# Altium schematic sheet ADC.SchDoc: EEG Measurement Circuit
size A2; Date: 24/01/2025; DrawnBy: Giang Phan Truong; SheetNumber: 5; SheetTotal: 7; SPICEModelCacheAOHYPSCX: <root> / <DocumentId>AOHYPSCX</DocumentId> / <CacheFrame Number="0"> / <Model Name="0402_885012005063_220pf" Kind="CKT"> / <Text>******* / .subckt 0402_885012005063_220pF 1 2 / Rser 1 3 0.0328677075671 / Lser 2 4 3.55619232E-10 / C1 3 4 0.00000000022 / Rpar 3 4 10000000000 / .ends 0402_885012005063_220pF</Text> / </Model> / <Model Name="0402_885012205060_680pf" Kind="CKT"> / <Text>******* / .subckt 0402_885012205060_680pF 1 2 / Rser 1 3 0.291776877274 / Lser 2 4 1.90727531E-10 / C1 3 4 0.00000000068 / Rpar 3 4 10000000000 / .ends 0402_885012205060_680pF</Text> / </Model> / <Model Name="0402_885012205086_100nf" Kind="CKT"> / <Text>******* / .subckt 0402_885012205086_100nF 1 2 / Rser 1 3 0.07 / Lser 2 4 0.00000000055 / C1 3 4 0.0000001 / Rpar 3 4 1000000000 / .ends 0402_885012205086_100nF</Text> / </Model> / <Model Name="0402_885012105012_1uf" Kind="CKT"> / <Text>******* / .subckt 0402_885012105012_1uF 1 2 / Rser 1 3 0.00986403339919 / Lser 2 4 3.2821055E-10 / C1 3 4 0.000001 / Rpar 3 4 50000000 / .ends 0402_885012105012_1uF</Text> / </Model> / </CacheFrame> / </root>
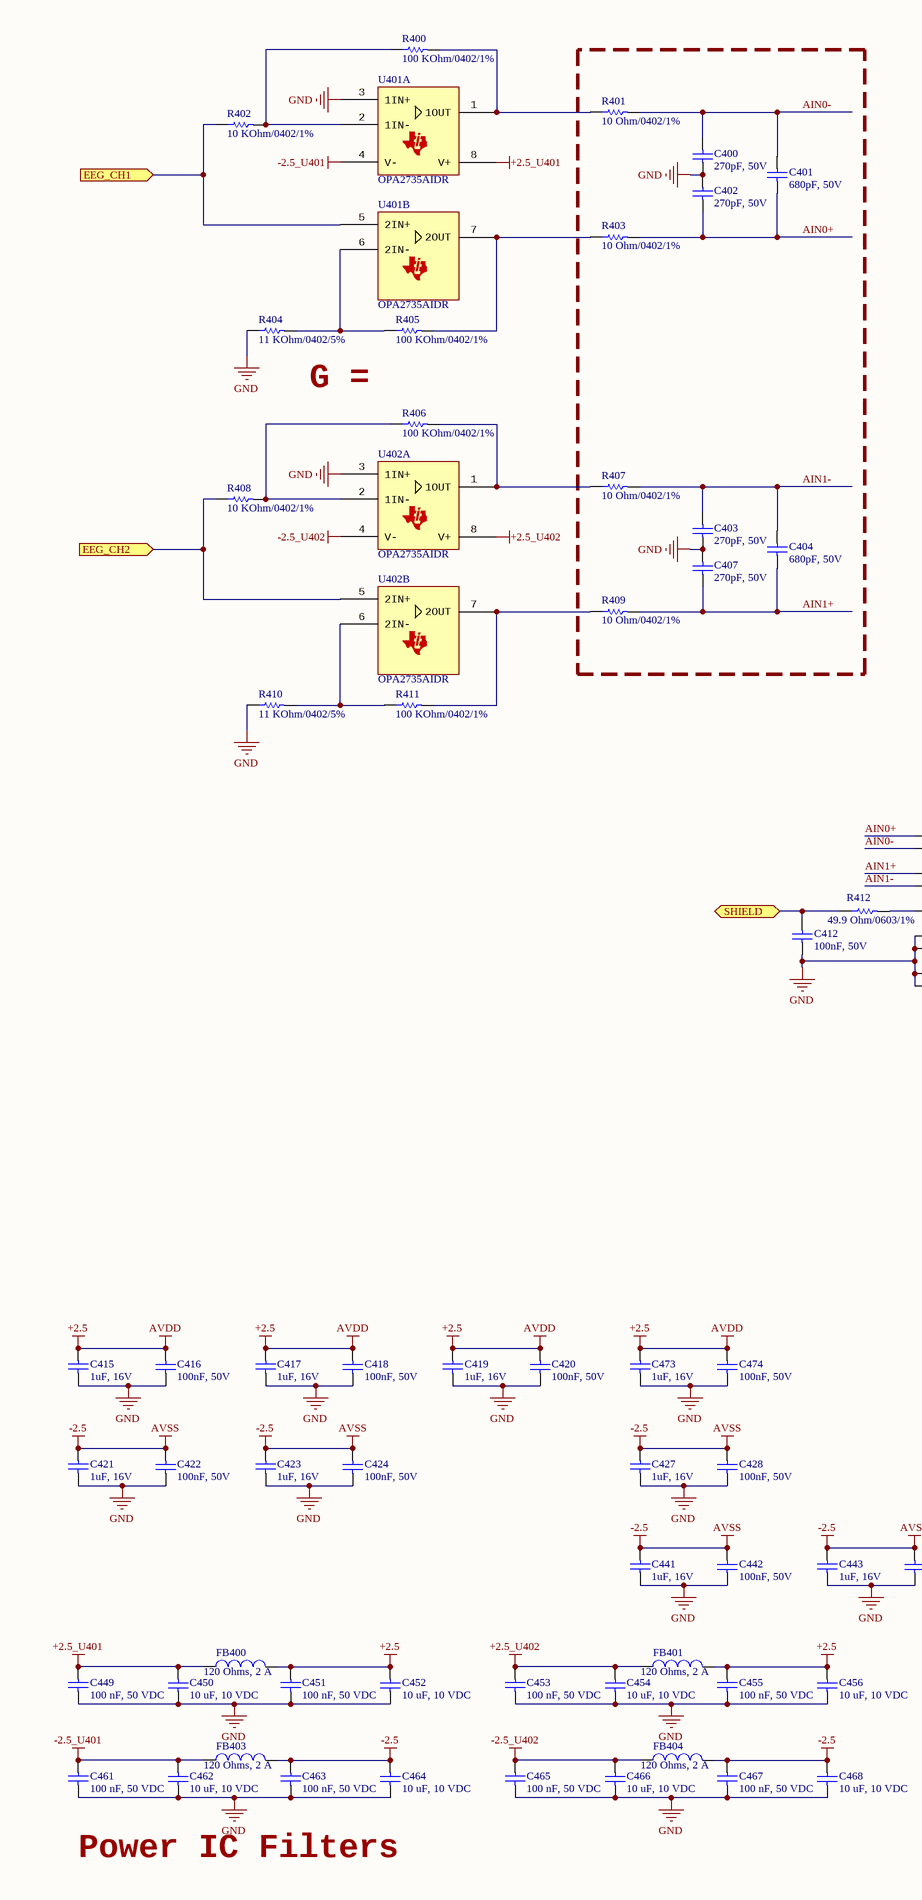
[diagram p0: ADC.SchDoc, left]
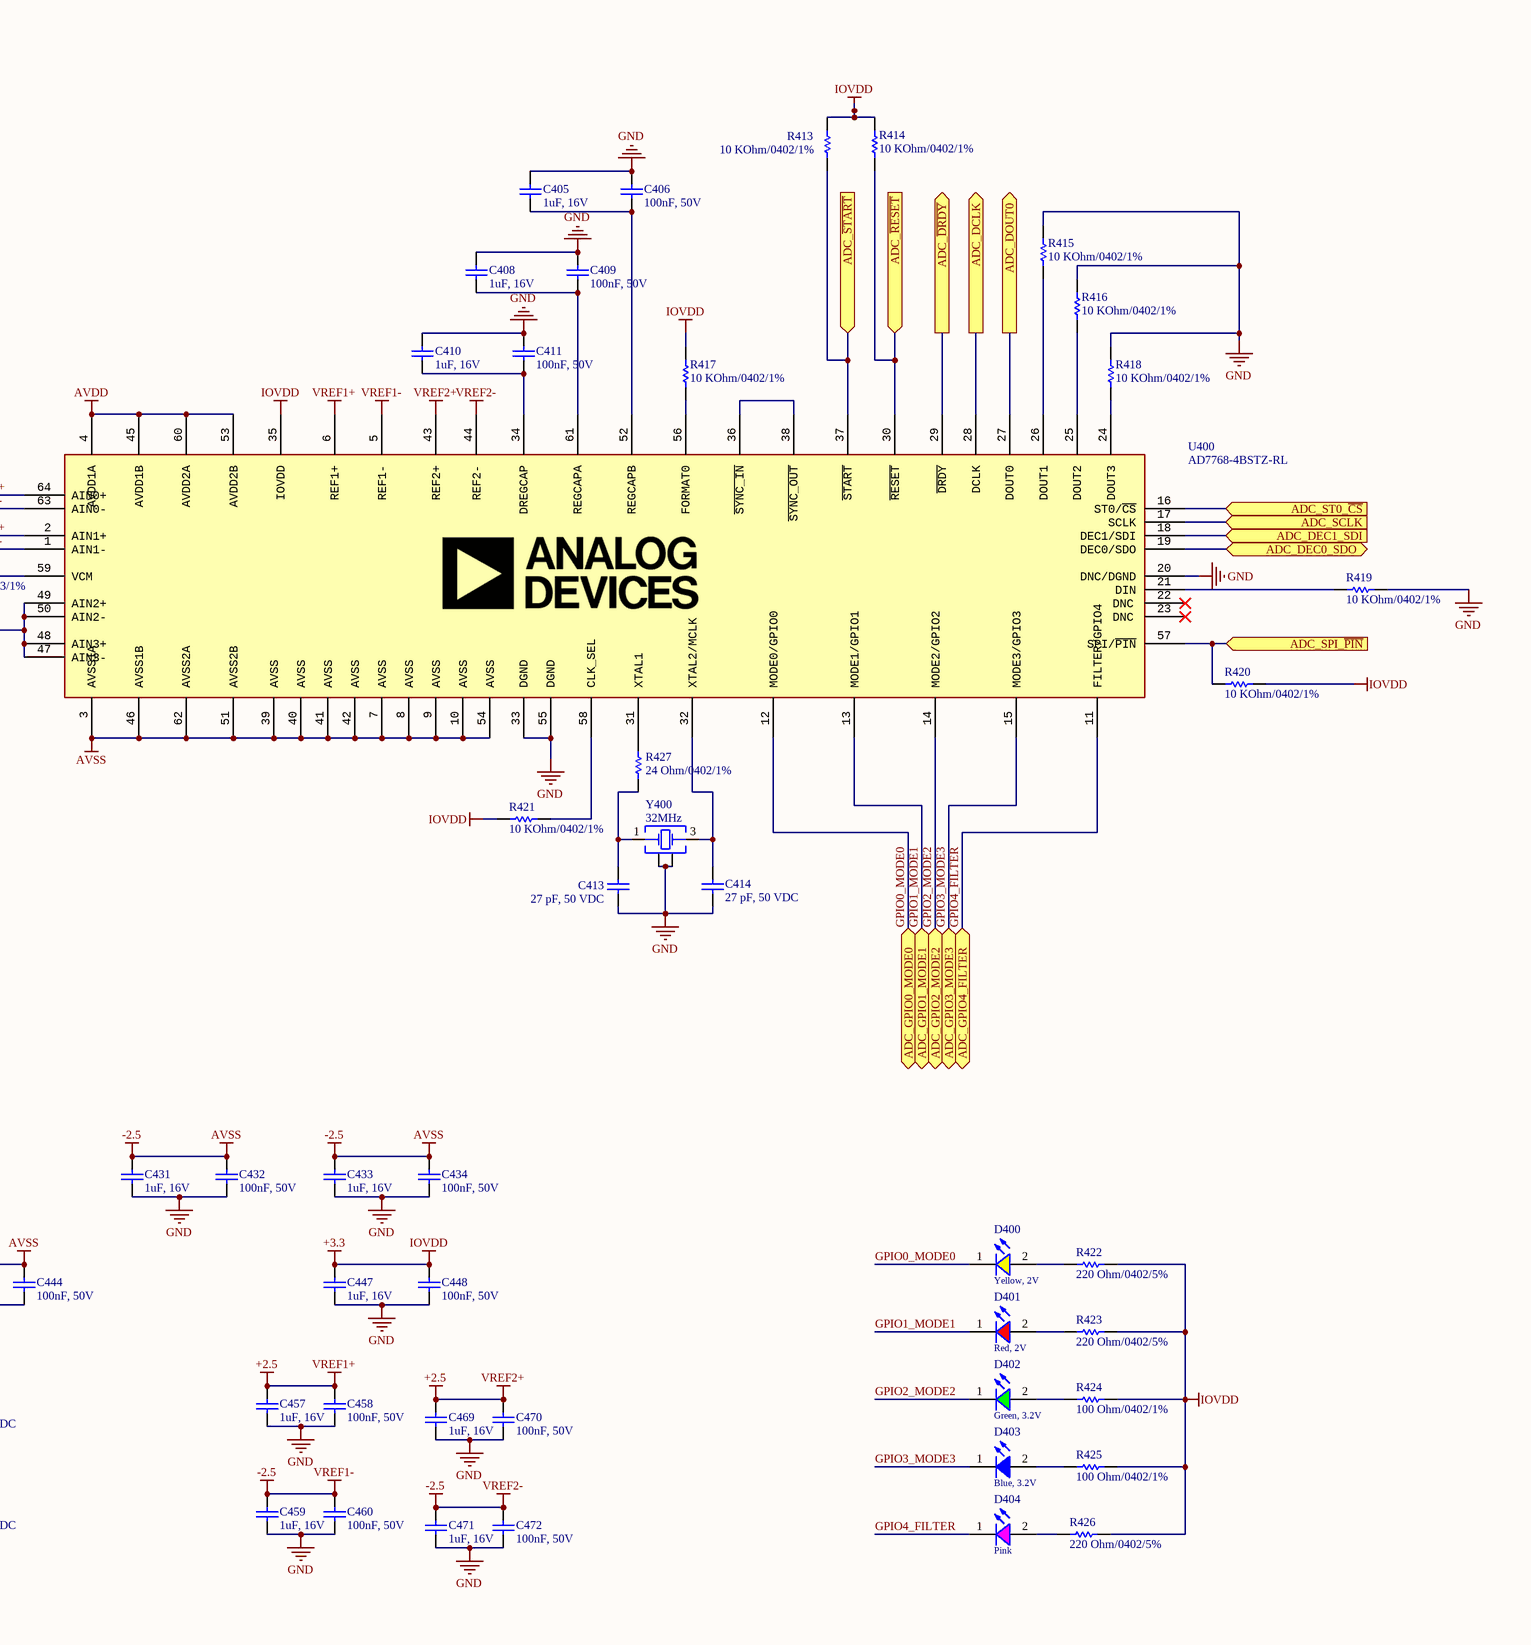
[diagram p1: ADC.SchDoc, right]

## Parts
C400  value 270pF, 50V  [WCAP-CSGP_0402_L1W0.5H0.5]  (hidden comment: 220pF)
C401  value 680pF, 50V  [WCAP-CSGP_0402_L1W0.5H0.5]  (hidden comment: 680pF)
C402  value 270pF, 50V  [WCAP-CSGP_0402_L1W0.5H0.5]  (hidden comment: 220pF)
C403  value 270pF, 50V  [WCAP-CSGP_0402_L1W0.5H0.5]  (hidden comment: 220pF)
C404  value 680pF, 50V  [WCAP-CSGP_0402_L1W0.5H0.5]  (hidden comment: 680pF)
C405  value 1uF, 16V  [WCAP-CSGP_0402_L1W0.5H0.5]  (hidden comment: 1μF)
C406  value 100nF, 50V  [WCAP-CSGP_0402_L1W0.5H0.5]  (hidden comment: 100nF)
C407  value 270pF, 50V  [WCAP-CSGP_0402_L1W0.5H0.5]  (hidden comment: 220pF)
C408  value 1uF, 16V  [WCAP-CSGP_0402_L1W0.5H0.5]  (hidden comment: 1μF)
C409  value 100nF, 50V  [WCAP-CSGP_0402_L1W0.5H0.5]  (hidden comment: 100nF)
C410  value 1uF, 16V  [WCAP-CSGP_0402_L1W0.5H0.5]  (hidden comment: 1μF)
C411  value 100nF, 50V  [WCAP-CSGP_0402_L1W0.5H0.5]  (hidden comment: 100nF)
C412  value 100nF, 50V  [WCAP-CSGP_0402_L1W0.5H0.5]  (hidden comment: 100nF)
C413  27 pF, 50 VDC  [CAP_0603]
C414  27 pF, 50 VDC  [CAP_0603]
C415  value 1uF, 16V  [WCAP-CSGP_0402_L1W0.5H0.5]  (hidden comment: 1μF)
C416  value 100nF, 50V  [WCAP-CSGP_0402_L1W0.5H0.5]  (hidden comment: 100nF)
C417  value 1uF, 16V  [WCAP-CSGP_0402_L1W0.5H0.5]  (hidden comment: 1μF)
C418  value 100nF, 50V  [WCAP-CSGP_0402_L1W0.5H0.5]  (hidden comment: 100nF)
C419  value 1uF, 16V  [WCAP-CSGP_0402_L1W0.5H0.5]  (hidden comment: 1μF)
C420  value 100nF, 50V  [WCAP-CSGP_0402_L1W0.5H0.5]  (hidden comment: 100nF)
C421  value 1uF, 16V  [WCAP-CSGP_0402_L1W0.5H0.5]  (hidden comment: 1μF)
C422  value 100nF, 50V  [WCAP-CSGP_0402_L1W0.5H0.5]  (hidden comment: 100nF)
C423  value 1uF, 16V  [WCAP-CSGP_0402_L1W0.5H0.5]  (hidden comment: 1μF)
C424  value 100nF, 50V  [WCAP-CSGP_0402_L1W0.5H0.5]  (hidden comment: 100nF)
C427  value 1uF, 16V  [WCAP-CSGP_0402_L1W0.5H0.5]  (hidden comment: 1μF)
C428  value 100nF, 50V  [WCAP-CSGP_0402_L1W0.5H0.5]  (hidden comment: 100nF)
C431  value 1uF, 16V  [WCAP-CSGP_0402_L1W0.5H0.5]  (hidden comment: 1μF)
C432  value 100nF, 50V  [WCAP-CSGP_0402_L1W0.5H0.5]  (hidden comment: 100nF)
C433  value 1uF, 16V  [WCAP-CSGP_0402_L1W0.5H0.5]  (hidden comment: 1μF)
C434  value 100nF, 50V  [WCAP-CSGP_0402_L1W0.5H0.5]  (hidden comment: 100nF)
C441  value 1uF, 16V  [WCAP-CSGP_0402_L1W0.5H0.5]  (hidden comment: 1μF)
C442  value 100nF, 50V  [WCAP-CSGP_0402_L1W0.5H0.5]  (hidden comment: 100nF)
C443  value 1uF, 16V  [WCAP-CSGP_0402_L1W0.5H0.5]  (hidden comment: 1μF)
C444  value 100nF, 50V  [WCAP-CSGP_0402_L1W0.5H0.5]  (hidden comment: 100nF)
C447  value 1uF, 16V  [WCAP-CSGP_0402_L1W0.5H0.5]  (hidden comment: 1μF)
C448  value 100nF, 50V  [WCAP-CSGP_0402_L1W0.5H0.5]  (hidden comment: 100nF)
C449  100 nF, 50 VDC  [CAP_0603]
C450  10 uF, 10 VDC  [CAP_0603]
C451  100 nF, 50 VDC  [CAP_0603]
C452  10 uF, 10 VDC  [CAP_0603]
C453  100 nF, 50 VDC  [CAP_0603]
C454  10 uF, 10 VDC  [CAP_0603]
C455  100 nF, 50 VDC  [CAP_0603]
C456  10 uF, 10 VDC  [CAP_0603]
C457  value 1uF, 16V  [WCAP-CSGP_0402_L1W0.5H0.5]  (hidden comment: 1μF)
C458  value 100nF, 50V  [WCAP-CSGP_0402_L1W0.5H0.5]  (hidden comment: 100nF)
C459  value 1uF, 16V  [WCAP-CSGP_0402_L1W0.5H0.5]  (hidden comment: 1μF)
C460  value 100nF, 50V  [WCAP-CSGP_0402_L1W0.5H0.5]  (hidden comment: 100nF)
C461  100 nF, 50 VDC  [CAP_0603]
C462  10 uF, 10 VDC  [CAP_0603]
C463  100 nF, 50 VDC  [CAP_0603]
C464  10 uF, 10 VDC  [CAP_0603]
C465  100 nF, 50 VDC  [CAP_0603]
C466  10 uF, 10 VDC  [CAP_0603]
C467  100 nF, 50 VDC  [CAP_0603]
C468  10 uF, 10 VDC  [CAP_0603]
C469  value 1uF, 16V  [WCAP-CSGP_0402_L1W0.5H0.5]  (hidden comment: 1μF)
C470  value 100nF, 50V  [WCAP-CSGP_0402_L1W0.5H0.5]  (hidden comment: 100nF)
C471  value 1uF, 16V  [WCAP-CSGP_0402_L1W0.5H0.5]  (hidden comment: 1μF)
C472  value 100nF, 50V  [WCAP-CSGP_0402_L1W0.5H0.5]  (hidden comment: 100nF)
C473  value 1uF, 16V  [WCAP-CSGP_0402_L1W0.5H0.5]  (hidden comment: 1μF)
C474  value 100nF, 50V  [WCAP-CSGP_0402_L1W0.5H0.5]  (hidden comment: 100nF)
D400  Yellow, 2V  [WL-SMCW_0603_H=0.7mm]
D401  Red, 2V  [WL-SMCW_0603_H=0.7mm]
D402  Green, 3.2V  [WL-SMCW_0603_H=0.7mm]
D403  Blue, 3.2V  [WL-SMCW_0603_H=0.7mm]
D404  Pink  [WL-SMCW_0603_H=0.7mm]
FB400  120 Ohms, 2 A  [FER_0603]
FB401  120 Ohms, 2 A  [FER_0603]
FB403  120 Ohms, 2 A  [FER_0603]
FB404  120 Ohms, 2 A  [FER_0603]
R400  value 100 KOhm/0402/1%  [R0402]  (hidden comment: Resistor 100 KOhm 0402 1%)
R401  value 10 Ohm/0402/1%  [R0402]  (hidden comment: Resistor 10 Ohm 0402 1%)
R402  value 10 KOhm/0402/1%  [R0402]  (hidden comment: Resistor 10 KOhm 0402 1%)
R403  value 10 Ohm/0402/1%  [R0402]  (hidden comment: Resistor 10 Ohm 0402 1%)
R404  value 11 KOhm/0402/5%  [R0402]  (hidden comment: Resistor 11 KOhm 0402 5%)
R405  value 100 KOhm/0402/1%  [R0402]  (hidden comment: Resistor 100 KOhm 0402 1%)
R406  value 100 KOhm/0402/1%  [R0402]  (hidden comment: Resistor 100 KOhm 0402 1%)
R407  value 10 Ohm/0402/1%  [R0402]  (hidden comment: Resistor 10 Ohm 0402 1%)
R408  value 10 KOhm/0402/1%  [R0402]  (hidden comment: Resistor 10 KOhm 0402 1%)
R409  value 10 Ohm/0402/1%  [R0402]  (hidden comment: Resistor 10 Ohm 0402 1%)
R410  value 11 KOhm/0402/5%  [R0402]  (hidden comment: Resistor 11 KOhm 0402 5%)
R411  value 100 KOhm/0402/1%  [R0402]  (hidden comment: Resistor 100 KOhm 0402 1%)
R412  value 49.9 Ohm/0603/1%  [R0603]  (hidden comment: Resistor 49.9 Ohm 0603 1%)
R413  value 10 KOhm/0402/1%  [R0402]  (hidden comment: Resistor 10 KOhm 0402 1%)
R414  value 10 KOhm/0402/1%  [R0402]  (hidden comment: Resistor 10 KOhm 0402 1%)
R415  value 10 KOhm/0402/1%  [R0402]  (hidden comment: Resistor 10 KOhm 0402 1%)
R416  value 10 KOhm/0402/1%  [R0402]  (hidden comment: Resistor 10 KOhm 0402 1%)
R417  value 10 KOhm/0402/1%  [R0402]  (hidden comment: Resistor 10 KOhm 0402 1%)
R418  value 10 KOhm/0402/1%  [R0402]  (hidden comment: Resistor 10 KOhm 0402 1%)
R419  value 10 KOhm/0402/1%  [R0402]  (hidden comment: Resistor 10 KOhm 0402 1%)
R420  value 10 KOhm/0402/1%  [R0402]  (hidden comment: Resistor 10 KOhm 0402 1%)
R421  value 10 KOhm/0402/1%  [R0402]  (hidden comment: Resistor 10 KOhm 0402 1%)
R422  value 220 Ohm/0402/5%  [R0402]  (hidden comment: Resistor 220 Ohm 0402 5%)
R423  value 220 Ohm/0402/5%  [R0402]  (hidden comment: Resistor 220 Ohm 0402 5%)
R424  value 100 Ohm/0402/1%  [R0402]  (hidden comment: Resistor 100 Ohm 0402 1%)
R425  value 100 Ohm/0402/1%  [R0402]  (hidden comment: Resistor 100 Ohm 0402 1%)
R426  value 220 Ohm/0402/5%  [R0402]  (hidden comment: Resistor 220 Ohm 0402 5%)
R427  value 24 Ohm/0402/1%  [R0402]  (hidden comment: Resistor 24 Ohm 0402 1%)
U400  value AD7768-4BSTZ-RL  [ST-64-2_ADI]  (hidden comment: 24 Bit Analog to Digital Converter 4 Input 4 Sigma-Delta)
U401  OPA2735AIDR  [SOIC-8]  (parts A,B of 2)
U402  OPA2735AIDR  [SOIC-8]  (parts A,B of 2)
Y400  32MHz  [WE-XTAL_CFPX-104]

## Ports
ADC_DCLK (out, see Block Diagram[5B], Digital Processing[4B]), ADC_DEC0_SDO (bidir, see Block Diagram[5B], Digital Processing[2B]), ADC_DEC1_SDI (in, see Block Diagram[5B], Digital Processing[2B]), ADC_DOUT0 (out, see Block Diagram[5B], Digital Processing[2C]), ADC_GPIO0_MODE0 (bidir, see Block Diagram[5B], Digital Processing[2C]), ADC_GPIO1_MODE1 (bidir, see Block Diagram[5B], Digital Processing[2B]), ADC_GPIO2_MODE2 (bidir, see Block Diagram[5B], Digital Processing[2B]), ADC_GPIO3_MODE3 (bidir, see Block Diagram[5B], Digital Processing[4B]), ADC_GPIO4_FILTER (bidir, see Block Diagram[5B], Digital Processing[4B]), ADC_SCLK (in, see Block Diagram[5B], Digital Processing[2B]), ADC_SPI_~{PIN} (in, see Block Diagram[5B], Digital Processing[2B]), ADC_ST0_~{CS} (in, see Block Diagram[5B], Digital Processing[2B]), ADC_~{DRDY} (out, see Block Diagram[5B], Digital Processing[2B]), ADC_~{RESET} (in, see Block Diagram[5B], Digital Processing[2B]), ADC_~{START} (in, see Block Diagram[5B], Digital Processing[2B]), EEG_CH1 (in, see Block Diagram[4B], EEG Preprocessing[7A]), EEG_CH2 (in, see Block Diagram[4B], EEG Preprocessing[7B]), SHIELD (bidir, see Block Diagram[4B], EEG Preprocessing[5C], Patient Protection[3B])

## Nets
+2.5: C415.1 C416.2 C417.1 C418.2 C419.1 C420.2 C451.1 C452.2 C455.1 C456.2 C457.1 C458.2 C469.1 C470.2 C473.1 C474.2 FB400.2 FB401.2 U400.4(AVDD1A) U400.6(REF1+) U400.43(REF2+) U400.45(AVDD1B) U400.53(AVDD2B) U400.60(AVDD2A)  [also labelled AVDD, VREF1+, VREF2+]
+2.5_U401: C449.1 C450.2 FB400.1 U401.8(V+)
+2.5_U402: C453.1 C454.2 FB401.1 U402.8(V+)
+3.3: C447.1 C448.2 R413.1 R414.1 R417.1 R420.1 R421.2 R422.2 R423.2 R424.2 R425.2 R426.2 U400.35(IOVDD)  [also labelled IOVDD]
-2.5: C421.1 C422.2 C423.1 C424.2 C427.1 C428.2 C431.1 C432.2 C433.1 C434.2 C441.1 C442.2 C443.1 C444.2 C459.1 C460.2 C463.1 C464.2 C467.1 C468.2 C471.1 C472.2 FB403.2 FB404.2 U400.3(AVSS1A) U400.5(REF1-) U400.7(AVSS) U400.8(AVSS) U400.9(AVSS) U400.10(AVSS) U400.39(AVSS) U400.40(AVSS) U400.41(AVSS) U400.42(AVSS) U400.44(REF2-) U400.46(AVSS1B) U400.51(AVSS2B) U400.54(AVSS) U400.62(AVSS2A)  [also labelled AVSS, VREF1-, VREF2-]
-2.5_U401: C461.1 C462.2 FB403.1 U401.4(V-)
-2.5_U402: C465.1 C466.2 FB404.1 U402.4(V-)
GND: C400.1 C402.2 C403.1 C405.1 C406.2 C407.2 C408.1 C409.2 C410.1 C411.2 C412.1 C413.1 C414.1 C415.2 C416.1 C417.2 C418.1 C419.2 C420.1 C421.2 C422.1 C423.2 C424.1 C427.2 C428.1 C431.2 C432.1 C433.2 C434.1 C441.2 C442.1 C443.2 C444.1 C447.2 C448.1 C449.2 C450.1 C451.2 C452.1 C453.2 C454.1 C455.2 C456.1 C457.2 C458.1 C459.2 C460.1 C461.2 C462.1 C463.2 C464.1 C465.2 C466.1 C467.2 C468.1 C469.2 C470.1 C471.2 C472.1 C473.2 C474.1 R404.1 R410.1 R415.1 R416.1 R418.1 R419.1 U400.20(DNC/DGND) U400.33(DGND) U400.47(AIN3-) U400.48(AIN3+) U400.49(AIN2+) U400.50(AIN2-) U400.55(DGND) U401.3(1IN+) U402.3(1IN+) Y400.2(GND_&_Lid) Y400.4(GND_&_Lid)
ADC_~{DRDY}: U400.29(~{DRDY}) ; port ADC_~{DRDY}
ADC_DCLK: U400.28(DCLK) ; port ADC_DCLK
ADC_DEC0_SDO: U400.19(DEC0/SDO) ; port ADC_DEC0_SDO
ADC_DEC1_SDI: U400.18(DEC1/SDI) ; port ADC_DEC1_SDI
ADC_DOUT0: U400.27(DOUT0) ; port ADC_DOUT0
ADC_~{RESET}: R414.2 U400.30(~{RESET}) ; port ADC_~{RESET}
ADC_~{START}: R413.2 U400.37(~{START}) ; port ADC_~{START}
ADC_SCLK: U400.17(SCLK) ; port ADC_SCLK
ADC_SPI_~{PIN}: R420.2 U400.57(SPI/~{PIN}) ; port ADC_SPI_~{PIN}
ADC_ST0_~{CS}: U400.16(ST0/~{CS}) ; port ADC_ST0_~{CS}
AIN0+: C401.1 C402.1 R403.2 U400.64(AIN0+)
AIN0-: C400.2 C401.2 R401.2 U400.63(AIN0-)
AIN1+: C404.1 C407.1 R409.2 U400.2(AIN1+)
AIN1-: C403.2 C404.2 R407.2 U400.1(AIN1-)
EEG_CH1: R402.1 U401.5(2IN+) ; port EEG_CH1
EEG_CH2: R408.1 U402.5(2IN+) ; port EEG_CH2
GPIO0_MODE0: D400.1(K) U400.12(MODE0/GPIO0) ; port ADC_GPIO0_MODE0
GPIO1_MODE1: D401.1(K) U400.13(MODE1/GPIO1) ; port ADC_GPIO1_MODE1
GPIO2_MODE2: D402.1(K) U400.14(MODE2/GPIO2) ; port ADC_GPIO2_MODE2
GPIO3_MODE3: D403.1(K) U400.15(MODE3/GPIO3) ; port ADC_GPIO3_MODE3
GPIO4_FILTER: D404.1(K) U400.11(FILTER/GPIO4) ; port ADC_GPIO4_FILTER
SHIELD: C412.2 R412.1 ; port SHIELD
NetC405_2: C405.2 C406.1 U400.52(REGCAPB)
NetC408_2: C408.2 C409.1 U400.61(REGCAPA)
NetC410_2: C410.2 C411.1 U400.34(DREGCAP)
NetC413_2: C413.2 R427.1 Y400.1(Crystal)
NetC414_2: C414.2 U400.32(XTAL2/MCLK) Y400.3(Crystal)
NetD400_2: D400.2(A) R422.1
NetD401_2: D401.2(A) R423.1
NetD402_2: D402.2(A) R424.1
NetD403_2: D403.2(A) R425.1
NetD404_2: D404.2(A) R426.1
NetR400_1: R400.1 R402.2 U401.2(1IN-)
NetR400_2: R400.2 R401.1 U401.1(1OUT)
NetR403_1: R403.1 R405.2 U401.7(2OUT)
NetR404_2: R404.2 R405.1 U401.6(2IN-)
NetR406_1: R406.1 R408.2 U402.2(1IN-)
NetR406_2: R406.2 R407.1 U402.1(1OUT)
NetR409_1: R409.1 R411.2 U402.7(2OUT)
NetR410_2: R410.2 R411.1 U402.6(2IN-)
NetR412_2: R412.2 U400.59(VCM)
NetR415_2: R415.2 U400.26(DOUT1)
NetR416_2: R416.2 U400.25(DOUT2)
NetR417_2: R417.2 U400.56(FORMAT0)
NetR418_2: R418.2 U400.24(DOUT3)
NetR419_2: R419.2 U400.21(DIN)
NetR421_1: R421.1 U400.58(CLK_SEL)
NetR427_2: R427.2 U400.31(XTAL1)
NetU400_36: U400.36(~{SYNC_IN}) U400.38(~{SYNC_OUT})

Not connected (* = marked no-connect by the designer): U400 22(DNC)* 23(DNC)*

## Notes on the sheet
- G = 10.0V/V
- Power IC Filters
- Project Name:
- Date:
- Size
- Size:
- A2
- Last Modified:
- Revision:
- Drawn By:
- File:
- Checked By:
- Sheet
- of

## Library data of the parts
C400 C402 C403 C407 = 885012005063: WCAP-CSGP Multilayer Ceramic Chip Capacitor, General Purpose, size 0402, NP0, 270pF, 50V; Manufacturer: Wurth Elektronik; Case/Size Code: 0402; Capacitance Tolerance: +/-5%; Insulation Resistance: 10GΩ; Q Factor: 1000; Technical Reference: NP00402221J050DFCT10000; Manufacturer Part Number: 885012005063; Category: Multilayer Ceramic Chip Capacitors; Match Code: WCAP-CSGP; ComponentLink1Description: Website Link; ComponentLink1URL: https://www.we-online.com/redexpert/article/885012005063?ad; ComponentLink2Description: Datasheet Link; ComponentLink2URL: https://www.we-online.com/redexpert/spec/885012005063?ad; Mount: Surface Mount; Min Operating Temperature: -55°C; Max Operating Temperature: 125°C; Packaging: Tape and Reel; Length: 1mm; Width: 0.5mm; Height: 0.5mm; Capacitance: 220pF; Ceramic Type: NP0; Rated Voltage (DC): 50V; Buy: https://www.digikey.com/en/products/detail/kemet/C0402C271J5GACTU/2269192
C401 C404 = 885012205060: WCAP-CSGP Multilayer Ceramic Chip Capacitor, General Purpose, size 0402, X7R, 680pF, 50V; Manufacturer: Wurth Elektronik; Case/Size Code: 0402; Capacitance Tolerance: +/-10%; Dissipation Factor: 2.5%; Insulation Resistance: 10GΩ; Technical Reference: X7R0402681K050DFCT10000; Manufacturer Part Number: 885012205060; Category: Multilayer Ceramic Chip Capacitors; Match Code: WCAP-CSGP; ComponentLink1Description: Website Link; ComponentLink1URL: https://www.we-online.com/redexpert/article/885012205060?ad; ComponentLink2Description: Datasheet Link; ComponentLink2URL: https://www.we-online.com/redexpert/spec/885012205060?ad; Mount: Surface Mount; Min Operating Temperature: -55°C; Max Operating Temperature: 125°C; Packaging: Tape and Reel; Length: 1mm; Width: 0.5mm; Height: 0.5mm; Capacitance: 680pF; Ceramic Type: X7R; Rated Voltage (DC): 50V; Buy: https://www.digikey.com/en/products/detail/murata-electronics/GRM1555C1H681JA01D/702505
C405 C408 C410 C415 C417 C419 C421 C423 C427 C431 C433 C441 C443 C447 C457 C459 C469 C471 C473 = 885012105012: 1 µF ±10% 16V Ceramic Capacitor X7R 0603 (1608 Metric); Manufacturer: Wurth Elektronik; Match Code: WCAP-CSGP; Case/Size Code: 0402; Capacitance Tolerance: +/-20%; Ceramic Type: X5R; Dissipation Factor: 15%; Insulation Resistance: 0.05GΩ; Rated Voltage (DC): 10V; Technical Reference: X5R0402105M010DFCT10000; Manufacturer Part Number: 885012105012; Category: Multilayer Ceramic Chip Capacitors; ComponentLink1Description: Website Link; ComponentLink1URL: https://www.we-online.com/redexpert/article/885012105012?ad; ComponentLink2Description: Datasheet Link; ComponentLink2URL: https://www.we-online.com/redexpert/spec/885012105012?ad; Mount: Surface Mount; Min Operating Temperature: -55°C; Max Operating Temperature: 85°C; Packaging: Tape and Reel; Length: 1mm; Width: 0.5mm; Height: 0.5mm; Capacitance: 1μF; Buy: https://www.digikey.com/en/products/detail/kemet/C0603C105K4RACTU/2199788
C406 C409 C411 C412 C416 C418 C420 C422 C424 C428 C432 C434 C442 C444 C448 C458 C460 C470 C472 C474 = 885012205086: WCAP-CSGP Multilayer Ceramic Chip Capacitor, General Purpose, size 0402, X7R, 100nF, 50V; Manufacturer: Wurth Elektronik; Case/Size Code: 0402; Capacitance Tolerance: +/-10%; Dissipation Factor: 10%; Insulation Resistance: 0.5GΩ; Technical Reference: X7R0402104K050DFCT10000; Buy: tme.vn/Product.aspx?id=1812#page=pro_info; Manufacturer Part Number: 885012205086; Category: Multilayer Ceramic Chip Capacitors; Match Code: WCAP-CSGP; ComponentLink1Description: Website Link; ComponentLink1URL: https://www.we-online.com/redexpert/article/885012205086?ad; ComponentLink2Description: Datasheet Link; ComponentLink2URL: https://www.we-online.com/redexpert/spec/885012205086?ad; Mount: Surface Mount; Min Operating Temperature: -55°C; Max Operating Temperature: 125°C; Packaging: Tape and Reel; Length: 1mm; Width: 0.5mm; Height: 0.5mm; Capacitance: 100nF; Ceramic Type: X7R; Rated Voltage (DC): 50V
C413 C414 = 0106032200550: CAP, size 0603, 22 pF, 50 VDC; Manufacture Name: TDK; Manufacture SN: CGA3E2NP01H220J080AA; Tolerance: +/-5%; Voltage Rating DC: 50 VDC; Operating Temperature: -55 to +125degC; Packaging: Tape and Reel; Mounting Technology: SMT; Size: 0603; Supplier 1 Name: Mouser; Supplier 1 SN: 810-CGA3E2NP01H220JA; Supplier 1 URL: https://www.mouser.com/ProductDetail/TDK/CGA3E2NP01H220J080AA?qs=xLDY6iXSiQbIDiPJq57tVA%3D%3D&utm_source=mouser-refine-download&utm_medium=file&utm_campaign=CGA3E2NP01H220J080AA&utm_content=TDK; Supplier 2 Name: Digi-Key; Supplier 2 SN: 445-12401-2-ND; Supplier 2 URL: https://www.digikey.com/en/products/detail/tdk-corporation/cga3e2np01h220j080aa/3949637; Supplier 3 Name: thegioiic; Supplier 3 SN: N/A; Supplier 3 URL: N/A; Value: 27 pF, 50 VDC; Buy: https://tme.vn/Product.aspx?id=741#page=pro_info
C449 C451 C453 C455 C461 C463 C465 C467 = 0106031041050: CAP, size 0603, 100 nF, 50 VDC; Manufacture Name: TDK; Manufacture SN: CGA3E3X8R1H104K080AE; Capacitance: 100 nF; Tolerance: +/-10%; Voltage Rating DC: 50 VDC; ComponentLink2Description: Datasheet; ComponentLink2URL: https://product.tdk.com/system/files/dam/doc/product/capacitor/ceramic/mlcc/catalog/mlcc_automotive_soft_en.pdf?ref_disty=mouser; Operating Temperature: -55 to +125degC; Packaging: Tape and Reel; Mounting Technology: SMT; Size: 0603; Supplier 1 Name: Mouser; Supplier 1 SN: 810-CGA3E3X8R1H104KA; Supplier 1 URL: https://www.mouser.com/ProductDetail/TDK/CGA3E3X8R1H104K080AE?qs=nQSIdc08i%252Bd8g3IRRgU2bw%3D%3D&utm_source=mouser-refine-download&utm_medium=file&utm_campaign=CGA3E3X8R1H104K080AE&utm_content=TDK; Supplier 2 Name: Digi-Key; Supplier 2 SN: 445-173697-2-ND; Supplier 2 URL: https://www.digikey.com/en/products/detail/tdk-corporation/cga3e3x8r1h104k080ae/5809262; Supplier 3 Name: thegioiic; Supplier 3 SN: N/A; Supplier 3 URL: N/A; Value: 100 nF, 50 VDC; Buy: https://tme.vn/Product.aspx?id=739#page=pro_info
C450 C452 C454 C456 C462 C464 C466 C468 = 0106031061010: CAP, size 0603, 10 uF, 10 VDC; Manufacture Name: Samsung Electro-Mechanics; Manufacture SN: CL10A106KP8NNWC; Capacitance: 10 uF; Tolerance: +/-10%; Voltage Rating DC: 10 VDC; ComponentLink2Description: Datasheet; ComponentLink2URL: https://www.mouser.vn/datasheet/2/585/MLCC-1837944.pdf; Operating Temperature: -55 to +125degC; Packaging: Tape and Reel; Mounting Technology: SMT; Size: 0603; Supplier 1 Name: Mouser; Supplier 1 SN: 187-CL10A106KP8NNWC; Supplier 1 URL: https://www.mouser.vn/ProductDetail/Samsung-Electro-Mechanics/CL10A106KP8NNWC?qs=xZ%2FP%252Ba9zWqZx8LSX23YqWA%3D%3D&utm_source=mouser-refine-download&utm_medium=file&utm_campaign=CL10A106KP8NNWC&utm_content=Samsung-Electro-Mechanics; Supplier 2 Name: Digi-Key; Supplier 2 SN: 1276-CL10A106KP8NNWCTR-ND; Supplier 2 URL: https://www.digikey.com/en/products/detail/samsung-electro-mechanics/cl10a106kp8nnwc/16572907; Supplier 3 Name: thegioiic; Supplier 3 SN: N/A; Supplier 3 URL: https://www.thegioiic.com/tu-gom-0603-10uf-25v; Value: 10 uF, 10 VDC; Buy: https://tme.vn/Product.aspx?id=1165#page=pro_info
D400 = 160603YellowClear: WL-SMCW SMT Mono-color Chip LED Waterclear, size 0603, Yellow, 2V, 140deg; Type: Clear; Color: Yellow; Size: 0603; ComponentLink1Description: Datasheet link; ComponentLink1URL: N/A; ComponentLink2Description: Supplier 1 URL; ComponentLink2URL: https://www.mouser.com/ProductDetail/Wurth-Elektronik/150060YS75003?qs=Li%252BoUPsLEnvfob7qsAi9dA%3D%3D; ComponentLink3Description: Supplier 2 URL; ComponentLink3URL: https://www.digikey.com/en/products/detail/liteon/LTST-C191KSKT/386839; ComponentLink4Description: Supplier 3 URL; ComponentLink4URL: https://icdayroi.com/led-yellow-0603; Supplier 1 Name: Mouser; Supplier 1 SN: 710-150060YS75003; Supplier 1 URL: https://www.mouser.com/ProductDetail/Wurth-Elektronik/150060YS75003?qs=Li%252BoUPsLEnvfob7qsAi9dA%3D%3D; Supplier 2 Name: Digi-Key; Supplier 2 SN: 160-1448-2-ND; Supplier 2 URL: https://www.digikey.com/en/products/detail/liteon/LTST-C191KSKT/386839; Supplier 3 Name: ICDayRoi; Supplier 3 SN: N/A; Supplier 3 URL: https://icdayroi.com/led-yellow-0603; Value: Yellow, 2V
D401 = 160603RedClear: WL-SMCW SMT Mono-color Chip LED Waterclear, size 0603, Red, 2V, 140deg; Type: Clear; Color: Red; Size: 0603; ComponentLink1Description: Datasheet link; ComponentLink1URL: N/A; ComponentLink2Description: Supplier 1 URL; ComponentLink2URL: https://www.mouser.vn/ProductDetail/Wurth-Elektronik/150060RS75000?qs=LlUlMxKIyB3QnmZ3fw%2FVCA%3D%3D; ComponentLink3Description: Supplier 2 URL; ComponentLink3URL: https://www.digikey.com/en/products/detail/liteon/LTST-C191KRKT/386837; ComponentLink4Description: Supplier 3 URL; ComponentLink4URL: https://www.thegioiic.com/led-do-0603-dan-smd-trong-suot; Supplier 1 Name: Mouser; Supplier 1 SN: 710-150060RS75000; Supplier 1 URL: https://www.mouser.vn/ProductDetail/Wurth-Elektronik/150060RS75000?qs=LlUlMxKIyB3QnmZ3fw%2FVCA%3D%3D; Supplier 2 Name: Digi-Key; Supplier 2 SN: 160-1447-2-ND; Supplier 2 URL: https://www.digikey.com/en/products/detail/liteon/LTST-C191KRKT/386837; Supplier 3 Name: ICDayRoi; Supplier 3 SN: N/A; Supplier 3 URL: https://www.thegioiic.com/led-do-0603-dan-smd-trong-suot; Value: Red, 2V
D402 = 160603GreenClear: WL-SMCW SMT Mono-color Chip LED Waterclear, size 0603, Green, 3.2V, 140deg; Type: Clear; Color: Green; Size: 0603; ComponentLink1Description: Datasheet link; ComponentLink1URL: N/A; ComponentLink2Description: Supplier 1 URL; ComponentLink2URL: https://www.mouser.vn/ProductDetail/Wurth-Elektronik/150060GS75000?qs=LlUlMxKIyB0UYkq5lDO8nA%3D%3D; ComponentLink3Description: Supplier 2 URL; ComponentLink3URL: https://www.digikey.com/en/products/detail/liteon/LTST-C191KGKT/386835; ComponentLink4Description: Supplier 3 URL; ComponentLink4URL: https://www.thegioiic.com/led-xanh-la-0603-dan-smd-trong-suot; Supplier 1 Name: Mouser; Supplier 1 SN: 710-150060GS75000; Supplier 1 URL: https://www.mouser.vn/ProductDetail/Wurth-Elektronik/150060GS75000?qs=LlUlMxKIyB0UYkq5lDO8nA%3D%3D; Supplier 2 Name: Digi-Key; Supplier 2 SN: 160-1446-2-ND; Supplier 2 URL: https://www.digikey.com/en/products/detail/liteon/LTST-C191KGKT/386835; Supplier 3 Name: ICDayRoi; Supplier 3 SN: N/A; Supplier 3 URL: https://www.thegioiic.com/led-xanh-la-0603-dan-smd-trong-suot; Value: Green, 3.2V
D403 = 160603BlueBlur: WL-SMCW SMT Mono-color Chip LED Blur, size 0603, Blue, 3.2V, 140deg; Color: Blue; Size: 0603; Type: Blur; ComponentLink1Description: Datasheet link; ComponentLink1URL: N/A; ComponentLink2Description: Supplier 1 URL; ComponentLink2URL: https://www.mouser.vn/ProductDetail/ams-OSRAM/LB-Q39E-L2OO-35-1?qs=74fRo9GAWsz%2FeNvglIOl1w%3D%3D; ComponentLink3Description: Supplier 2 URL; ComponentLink3URL: https://www.digikey.com/en/products/detail/ams-osram-usa-inc/LB-Q39E-N1OO-35-1/2176321; ComponentLink4Description: Supplier 3 URL; ComponentLink4URL: N/A; Supplier 1 Name: Mouser; Supplier 1 SN: 720-LBQ39EL2N2351; Supplier 1 URL: https://www.mouser.vn/ProductDetail/ams-OSRAM/LB-Q39E-L2OO-35-1?qs=74fRo9GAWsz%2FeNvglIOl1w%3D%3D; Supplier 2 Name: Digi-Key; Supplier 2 SN: 475-LBQ39E-N1OO-35-1TR-ND; Supplier 2 URL: https://www.digikey.com/en/products/detail/ams-osram-usa-inc/LB-Q39E-N1OO-35-1/2176321; Supplier 3 Name: ICDayRoi; Supplier 3 SN: N/A; Supplier 3 URL: N/A; Value: Blue, 3.2V
D404 = 160603PinkBlur: WL-SMCW SMT Mono-color Chip LED Blur, size 0603, Pink; Color: Pink; Size: 0603; Type: Blur; ComponentLink1Description: Datasheet link; ComponentLink1URL: N/A; ComponentLink2Description: Supplier 1 URL; ComponentLink2URL: N/A; ComponentLink3Description: Supplier 2 URL; ComponentLink3URL: https://www.digikey.com/en/products/detail/rohm-semiconductor/SMLD12HBC7W1/3587026; ComponentLink4Description: Supplier 3 URL; ComponentLink4URL: N/A; Supplier 1 Name: Mouser; Supplier 1 SN: N/A; Supplier 1 URL: N/A; Supplier 2 Name: Digi-Key; Supplier 2 SN: 846-1108-2-ND; Supplier 2 URL: https://www.digikey.com/en/products/detail/rohm-semiconductor/SMLD12HBC7W1/3587026; Supplier 3 Name: ICDayRoi; Supplier 3 SN: N/A; Supplier 3 URL: N/A; Value: Pink
FB400 FB401 FB403 FB404 = 03060312120225: Ferrite, 0603, 120 Ohms, 2 A; Manufacture Name: Wurth Elektronik; Manufacture SN: 742792625; Tolerance: +/-25%; Maximum DC Current: 2 A; Maximum DC Resistance: 50 mOhms; Test Frequency: 100 MHz; Mounting Technology: SMT; Operating Temperature: -55 to +125degC; Packaging: Tape and Reel; Size: 0603; Supplier 1 SN: 710-742792625; Supplier 1 URL: https://www.mouser.com/ProductDetail/Wurth-Elektronik/742792625?qs=sGAEpiMZZMt1hubY80%2Fs8OCciRuv%2FFk6PJE4za4cFPDWegNO%252Bf6fVw%3D%3D&utm_source=mouser-refine-download&utm_medium=file&utm_campaign=742792625&utm_content=Wurth-Elektronik; Supplier 2 SN: N/A; Supplier 2 URL: N/A; Supplier 3 SN: N/A; Supplier 3 URL: N/A; Supplier 1 Name: Mouser; Supplier 2 Name: Digi-Key; Supplier 3 Name: thegioiic; Impedance: 120 Ohms; Value: 120 Ohms, 2 A; Buy: https://linhkien.cxtvn.com/9545-blm18sg121tn1d-ferrite-bead-120-ohm-0603-1ln-10c.html
R400 R405 R406 R411 = Resistor 100 KOhm 0402 1%: Code 104, 1/16W 1%; ComponentLink1Description: Buy; ComponentLink1URL: https://www.thegioiic.com/dien-tro-100-kohm-0402-1-
R401 R403 R407 R409 = Resistor 10 Ohm 0402 1%: 10 Ohms ±1% 0.063W, 1/16W Chip Resistor 0402 (1005 Metric) Moisture Resistant Thick Film; Buy: https://www.digikey.com/en/products/detail/yageo/RC0402FR-0710RL/726524
R402 R408 R413-R421 = Resistor 10 KOhm 0402 1%: Code 103, 1/16W 1%; ComponentLink1Description: Buy; ComponentLink1URL: https://www.thegioiic.com/dien-tro-10-kohm-0402-1-
R404 R410 = Resistor 11 KOhm 0402 5%: Code 113, 1/16W 5%; ComponentLink1Description: Buy; ComponentLink1URL: https://www.thegioiic.com/dien-tro-10-kohm-0402-1-; Buy: https://www.thegioiic.com/dien-tro-11-kohm-0402-5-
R412 = Resistor 49.9 Ohm 0603 1%: RM06FTN49R9; Buy: http://tme.vn/Product.aspx?id=1857#page=pro_info
R422 R423 R426 = Resistor 220 Ohm 0402 5%: 220R (Code 221), 1/16W 5% 0402; Buy: https://www.thegioiic.com/dien-tro-220-ohm-0402-5-
R424 R425 = Resistor 100 Ohm 0402 1%: Code 104, 1/16W; ComponentLink1Description: Buy; ComponentLink1URL: https://www.thegioiic.com/dien-tro-100-ohm-0402-1-
R427 = Resistor 24 Ohm 0402 1%: 1/16W Thick Film Resistors 50V ±5% ±200ppm/℃ 24Ω 0402 Chip Resistor - Surface Mount ROHS; Buy: https://www.lcsc.com/product-detail/Chip-Resistor-Surface-Mount_FH-Guangdong-Fenghua-Advanced-Tech-RC-02W240JT_C258123.html?s_z=n_24%2520Ohm
U400 = AD7768-4BSTZ-RL: 24 Bit Analog to Digital Converter 4 Input 4 Sigma-Delta 64-LQFP (10x10); Mfr_Name: Analog Devices Inc; Type: Data Acquisition; RefDes: RefDes; ComponentLink1Description: Buy; ComponentLink1URL: https://www.digikey.com/en/products/detail/analog-devices-inc/AD7768-4BSTZ-RL/6056981
U401 U402 = OPA2735AIDR: 0.05μV/°C max, Single-Supply CMOS Operational Amplifiers Zero-drift Series; ComponentLink1Description: Buy; ComponentLink1URL: https://www.digikey.com/en/products/detail/texas-instruments/OPA2735AIDR/1572381; Value: OPA2735AIDR
Y400 = 830059535: WE-XTAL Quartz Crystal, SMT, CFPX-104, 32MHz, +/-20ppm; Manufacturer: Wurth Elektronik; Frequency Stability: +/-30ppm; Load Capacitance: 18pF; ComponentLink1Description: Website Link; ComponentLink1URL: https://www.we-online.com/redexpert/article/830059535?ad; ComponentLink2Description: Datasheet Link; ComponentLink2URL: https://www.we-online.com/redexpert/spec/830059535?ad; Manufacturer Part Number: 830059535; Category: Crystals; Match Code: WE-XTAL; Mount: Surface Mount; Operating Temperature Max: 85°C; Operating Temperature Min: -40°C; Packaging: Tape and Reel; Case/Size Code: CFPX-104; Length: 5mm; Width: 3.2mm; Height: 1mm; Frequency: 32MHz; Frequency Tolerance: +/-20ppm; Value: 32MHz